# Altium schematic sheet ESP32_connection.SchDoc
size B; SheetNumber: 1; SheetTotal: 3
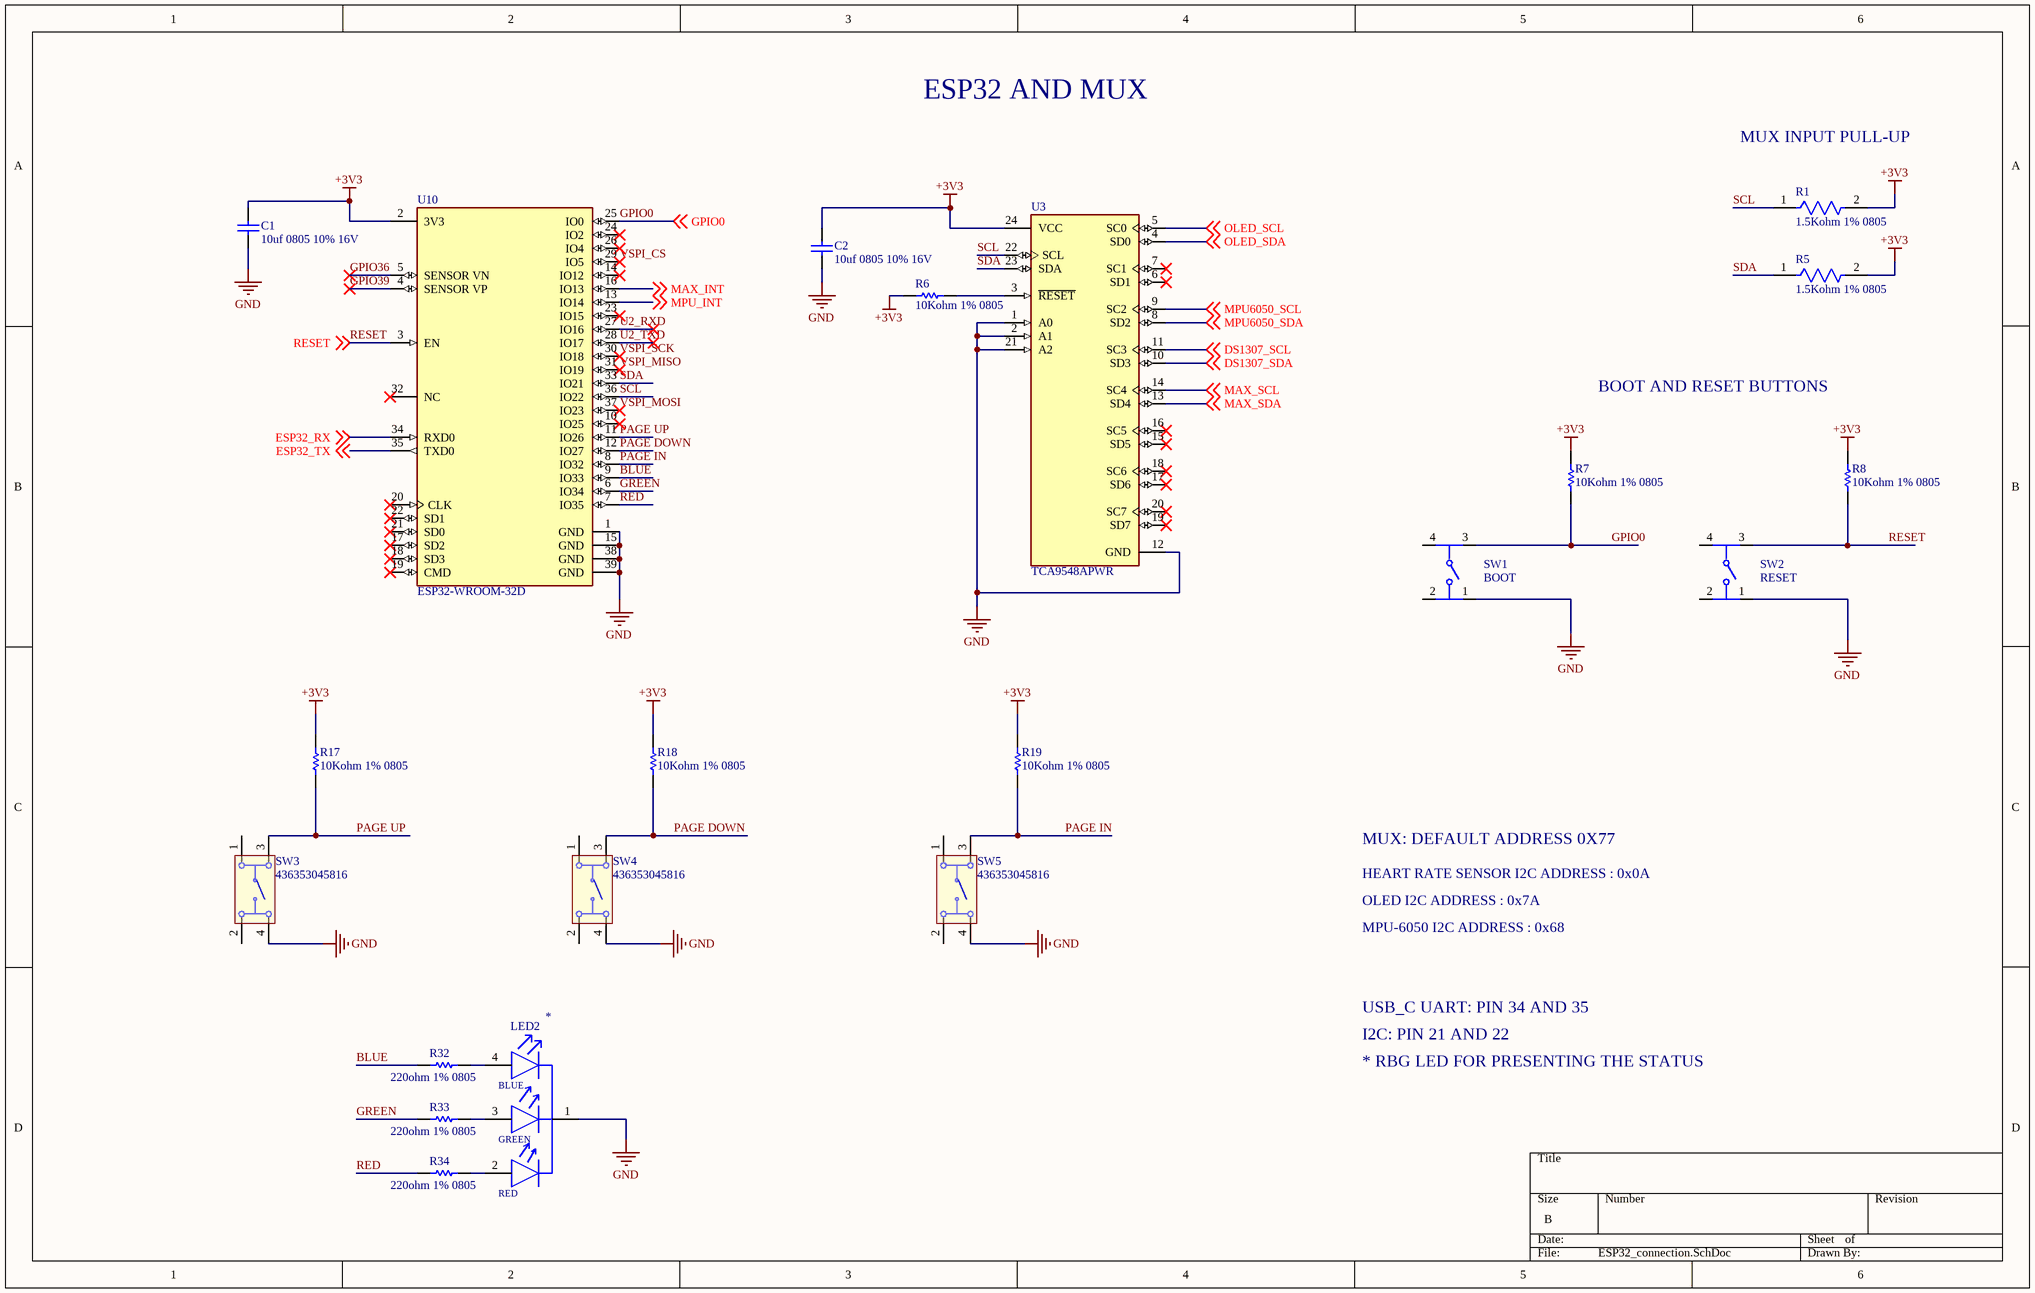
[diagram p0: ESP32_connection.SchDoc]

## Parts
C1  10uf 0805 10% 16V  [CAPC2013X140X50ML20T25]
C2  10uf 0805 10% 16V  [CAPC2013X140X50ML20T25]
LED2  APTF1616SEJ3ZGGVBDC  [FP-APTF1616SEJ3ZGGVBDC-MFG]  (value not drawn)
R1  1.5Kohm 1% 0805  [FP-RC2012-IPC_B]
R5  1.5Kohm 1% 0805  [FP-RC2012-IPC_B]
R6  10Kohm 1% 0805  [RESC2013X60X35NL10T20]
R7  10Kohm 1% 0805  [RESC2013X60X35NL10T20]
R8  10Kohm 1% 0805  [RESC2013X60X35NL10T20]
R17  10Kohm 1% 0805  [RESC2013X60X35NL10T20]
R18  10Kohm 1% 0805  [RESC2013X60X35NL10T20]
R19  10Kohm 1% 0805  [RESC2013X60X35NL10T20]
R32  220ohm 1% 0805  [RESC2013X70X40NL20T20]
R33  220ohm 1% 0805  [RESC2013X70X40NL20T20]
R34  220ohm 1% 0805  [RESC2013X70X40NL20T20]
SW1  BOOT  [FP-PTS810_SJG_250_SMTR_LF-MFG]
SW2  RESET  [FP-PTS810_SJG_250_SMTR_LF-MFG]
SW3  436353045816  [436353045816]
SW4  436353045816  [436353045816]
SW5  436353045816  [436353045816]
U3  TCA9548APWR  [FP-PW0024A-MFG]
U10  ESP32-WROOM-32D  [FP-ESP32-WROOM-32D-MFG]

## Nets
+3V3: C1.2 C2.2 R1.2 R5.2 R6.1 R7.1 R8.1 R17.1 R18.1 R19.1 U3.24(VCC) U10.2(3V3)
GND: C1.1 C2.1 LED2.1(COMMON_CATHODE) SW1.1 SW2.1 SW3.4 SW4.4 SW5.4 U3.1(A0) U3.2(A1) U3.12(GND) U3.21(A2) U10.1(GND) U10.15(GND) U10.38(GND) U10.39(GND)
BLUE: R32.1 U10.9(IO33)
DS1307_SCL: U3.11(SC3) ; off-sheet DS1307_SCL
DS1307_SDA: U3.10(SD3) ; off-sheet DS1307_SDA
ESP32_RX: U10.34(RXD0) ; off-sheet ESP32_RX
ESP32_TX: U10.35(TXD0) ; off-sheet ESP32_TX
GPIO0: R7.2 SW1.3 U10.25(IO0) ; off-sheet GPIO0
GPIO36: U10.5(SENSOR_VN)
GPIO39: U10.4(SENSOR_VP)
GREEN: R33.1 U10.6(IO34)
MAX_INT: U10.16(IO13) ; off-sheet MAX_INT
MAX_SCL: U3.14(SC4) ; off-sheet MAX_SCL
MAX_SDA: U3.13(SD4) ; off-sheet MAX_SDA
MPU6050_SCL: U3.9(SC2) ; off-sheet MPU6050_SCL
MPU6050_SDA: U3.8(SD2) ; off-sheet MPU6050_SDA
MPU_INT: U10.13(IO14) ; off-sheet MPU_INT
OLED_SCL: U3.5(SC0) ; off-sheet OLED_SCL
OLED_SDA: U3.4(SD0) ; off-sheet OLED_SDA
PAGE DOWN: R18.2 SW4.3 U10.12(IO27)
PAGE IN: R19.2 SW5.3 U10.8(IO32)
PAGE UP: R17.2 SW3.3 U10.11(IO26)
RED: R34.1 U10.7(IO35)
RESET: R8.2 SW2.3 U10.3(EN) ; off-sheet RESET
SCL: R1.1 U3.22(SCL) U10.36(IO22)
SDA: R5.1 U3.23(SDA) U10.33(IO21)
U2_RXD: U10.27(IO16)
U2_TXD: U10.28(IO17)
VSPI_CS: U10.29(IO5)
VSPI_MISO: U10.31(IO19)
VSPI_MOSI: U10.37(IO23)
VSPI_SCK: U10.30(IO18)
NetLED2_2: LED2.2(RED_A) R34.2
NetLED2_3: LED2.3(GREEN_A) R33.2
NetLED2_4: LED2.4(BLUE_A) R32.2
NetR6_2: R6.2 U3.3(~{RESET})

Not connected (* = marked no-connect by the designer): SW1 2 4; SW2 2 4; SW3 1 2; SW4 1 2; SW5 1 2; U3 6(SD1)* 7(SC1)* 15(SD5)* 16(SC5)* 17(SD6)* 18(SC6)* 19(SD7)* 20(SC7)*; U10 10(IO25)* 14(IO12)* 17(SD2)* 18(SD3)* 19(CMD)* 20(CLK)* 21(SD0)* 22(SD1)* 23(IO15)* 24(IO2)* 26(IO4)* 32(NC)*

## Notes on the sheet
- ESP32 AND MUX
- MUX INPUT PULL-UP
- BOOT AND RESET BUTTONS
- MUX: DEFAULT ADDRESS 0X77
- HEART RATE SENSOR I2C ADDRESS : 0x0A
- OLED I2C ADDRESS : 0x7A
- MPU-6050 I2C ADDRESS : 0x68
- (near LED2) *
- USB_C UART: PIN 34 AND 35
- I2C: PIN 21 AND 22
- (near LED2) BLUE
- * RBG LED FOR PRESENTING THE STATUS
- (near LED2) GREEN
- (near LED2) RED

## Library data of the parts
C1 C2 = CMP-1036-04927-2: Part Number: 0805YD106KAT2A; Manufacturer: AVX Interconnect / Elco
LED2 = CMP-44529-000025-1: LED RGB CLEAR 4SMD; Luminous Intensity: 140mcd; Test Current: 20mA; Forward Voltage: 3.3V; Lens Color: Colorless; Illumination Color: Blue; Viewing Angle: 120°; Dominant Wavelength: 470nm; Width: 1.6mm; Mount: Surface Mount; Height: 0.9mm; Case/Package: 0606; Max Operating Temperature: 85°C; Color: Blue; Lens Transparency: Clear; Min Operating Temperature: -40°C; Forward Current: 20mA; Length: 1.6mm; Packaging: Tape and Reel; Package Quantity: 2000
R1 R5 = CMP-13261-002474-1: Res Thick Film 0805 1.5kΩ 1% 0.125W ±100ppm/°C Molded SMD T/R; Resistance: 1.5kR; Voltage Rating (DC): 150V; Max Power Dissipation: 125mW; Case Code (Metric): 2012; Packaging: Tape and Reel; Features: Moisture Resistant; Temperature Coefficient: 100ppm/°C; Case Code (Imperial): 0805; Min Operating Temperature: -55°C; Contact Plating: Tin; Tolerance: 1%; Composition: Thick Film; Height: 0.024inch; Lead Free: Lead Free; Max Operating Temperature: 155°C; Length: 0.079inch; Radiation Hardening: No; Case/Package: 0805; Width: 0.049inch; Number of Terminations: 2
R6-R8 R17-R19 = CMP-1659-00013-4: Chip Resistor, 10 KOhm, +/- 1%, 0.125 W, -55 to 155 degC, 0805 (2012 Metric), RoHS, Tape and Reel; Manufacturer: Yageo; Voltage Rating: 150 V; Mount: Surface Mount; ComponentLink1Description: Manufacturer URL; ComponentLink2URL: http://www.yageo.com/documents/recent/PYu-RC_Group_51_RoHS_L_04.pdf; Pins: 2; Length: 2 mm; Min Operating Temperature: -55 degC; Height: 0.5 mm; Mounting Technology: Surface Mount; RoHSCompliant: true; REACH SVHC: No SVHC; ComponentLink1URL: http://www.yageo.com/; Max Operating Temperature: 155 degC; PackageReference: 0805; DatasheetVersion: Rev. 4, 02/2016; Package Quantity: 5000; Packaging: Tape and Reel; ComponentLink2Description: Datasheet; PackageDescription: 2-Pin Surface Mounted Device, Body 2 x 1.25 mm
R32-R34 = CMP-2001-00044-1: Part Number: ERJ6ENF2200V; Manufacturer: Panasonic
SW1 SW2 = CMP-10040-000011-1: SWITCH TACTILE SPST-NO 0.05A 16V; Manufacturer: C&K Components; Manufacturer Part Number: PTS810 SJG 250 SMTR LFS; Electromechanical Life: 100000Cycles; Contact Resistance: 500mΩ; Operating Force: 400gf; Current Rating: 50mA; Voltage Rating Dc: 16V; Device Class L2: Switches; Device Class L1: Electromechanical; ComponentLink2URL: https://www.ckswitches.com/media/1476/pts810.pdf; Digikey Description: SWITCH TACTILE SPST-NO 0.05A 16V; RoHS: TRUE; Temperature Range Low: -40°C; Temperature Range High: +85°C; Automotive: No; Category: Switch; ComponentLink2Description: Datasheet; Device Class L3: Tactile Switches; Mouser Description: Switch Tactile N.O. SPST Button J-Bend 0.05A 16VDC 100000Cycles 3.92N SMD T/R; Throw Configuration: SPST-NO; Package: PTS810 SJG 250 SMTR LFS; Height: 2.7mm; Octopart: https://octopart.com/pts810sjg250smtrlfs-c%26k+components-29380277; Temperature: -40°C to +85°C; Lead Free: Yes
SW3-SW5 = CMP-1464-00002-1: WS-TASU J-Bend J-Bend SMD Tact Switch with boss design 4.7X3.5 mm side push; Manufacturer: Wuerth Elektronik; ComponentLink1Description: Manufacturer URL; ComponentLink2Description: Datasheet; PackageReference: 436353045816; ComponentLink1URL: http://www.we-online.com; PartNumber: 436353045816; ComponentLink2URL: http://katalog.we-online.de/em/datasheet/436353045816.pdf
U3 = CMP-04892-000002-1: IC I2C SW 8CH W/RESET 24TSSOP; Manufacturer: Texas Instruments; Number Of Circuits: 1; Mux Demux Ratio: 1:8; Nominal Supply Current: 2-50uA; Interface: I2C,SMBus; Min Supply Voltage: 1.65V; Standoff Height: 0.05mm; Max Supply Voltage: 5.5V; Device Class L2: Interface ICs; ComponentLink2Description: Datasheet; Ipc Land Pattern Name: SOP65P640X120-24; Category: IC; Device Class L1: Integrated Circuits (ICs); Manufacturer Part Number: TCA9548APWR; RoHS: TRUE; Temperature Range High: +85°C; Digikey Description: IC I2C SW 8CH W/RESET 24TSSOP; Temperature Range Low: -40°C; Lead Free: Yes; Package: PW0024A; ComponentLink2URL: http://www.ti.com/lit/ds/symlink/tca9548a.pdf; Device Class L3: Multiplexers; Ambient Temperature Range Low: -40°C; Mouser Description: Low-Voltage 8-Channel I2C Switch With Reset 24-TSSOP -40 to 85; Temperature: -40°C to +85°C; Octopart: https://octopart.com/tca9548apwr-texas+instruments-22266789; Ambient Temperature Range High: +85°C; Automotive: No; Height: 1.2mm
U10 = CMP-194065-000003-1: WIFI MODULE 32MBITS SPI FLASH; Manufacturer: Espressif Systems; Max Supply Voltage: 3.6V; Nominal Supply Current: 500mA; Max Frequency: 2484MHz; Number Of Adc Channels: 16; Number Of Gpio: 32; Interface: I2C,SPI,UART,Ethernet,I2S,Other; Data Rate: 150Mbits/s; Min Supply Voltage: 3V; Bandwidth: 72MHz; Sensitivity: -98dBm; Octopart: https://octopart.com/esp32-wroom-32d-espressif+systems-91040050; Package: ESP32-WROOM-32D; ComponentLink2URL: https://www.espressif.com/sites/default/files/documentation/esp32-wroom-32d_esp32-wroom-32u_datasheet_en.pdf; Lead Free: Yes; Category: UNK; Mouser Description: Wi-Fi/BT BLE Module ESP32-D0WD, SPI Flash, UART, P; Device Class L1: Integrated Circuits (ICs); RoHS: TRUE; Temperature Range Low: -40°C; ComponentLink2Description: Datasheet; Digikey Description: WIFI MODULE 32MBITS SPI FLASH; Height: 3.2mm; Temperature: -40°C to +85°C; Manufacturer Part Number: ESP32-WROOM-32D; Device Class L3: Transceivers; Device Class L2: RF Semiconductors and Devices; Temperature Range High: +85°C; Automotive: No